# EAGLE schematic FM-Super-Regenerative-2 (EAGLE 7.2.0)
Pendelaudion Aus dem Sperrschicht-Feldeffekttransistor BF256B Super-Regen FM Radio: "Radio Shack Special" http://ryanzachry.com/2013/01/super-regen-fm-radio/
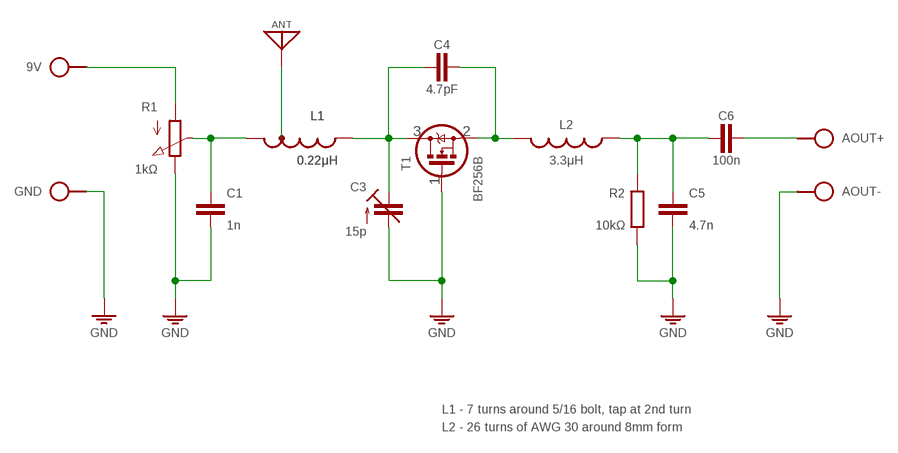
[diagram p0: schematic, sheet 1]

## Parts
9V  SPAD  [SPAD]
ANT  ANT  [SPAD]
AOUT+  SPAD  [SPAD]
AOUT-  SPAD  [SPAD]
C1  1n  C025-025X060  [C050-025X060]
C3  15p  C-TR-PH201272222-808-2PINB  [TRIM-2222-808]
C4  4.7pF  C025-020X036  [C025-020X036]
C5  4.7n  C050-020X044  [C050-020X044]
C6  100n  C050-020X044  [C050-020X044]
GND  SPAD  [SPAD]
L1  0.22μH  L-TAP1L-08/12-X-TAP1  [L-08/12-X-TAP1]
L2  3.3μH  L-BODY  [L-BODY]
R1  1kΩ  POT  [POT]
R2  10kΩ  R0204/10  [0204/10]
T1  BF256B  [TO92]

## Nets
GND: AOUT-.1 C1.2 C3.2(A) C5.2 GND.1 R1.3(E) R2.1 T1.1(G)
N$1: 9V.1 R1.1(A)
N$2: C3.3(E) C4.1 L1.2 T1.3(D)
N$3: C1.1 L1.1 R1.2(S)
N$4: ANT.1 L1.3(T)
N$5: C4.2 L2.3 T1.2(S)
N$6: C5.1 C6.1 L2.2 R2.2
N$8: AOUT+.1 C6.2

## Notes on the sheet
- L1 - 7 turns around 5/16 bolt, tap at 2nd turn
- L2 - 26 turns of AWG 30 around 8mm form

## Library data of the parts
9V AOUT+ AOUT- GND = pad:SPAD
ANT = pad:ANT
C1 C4-C6 = c:C: CAPACITOR, European symbol
C3 = cap-trim:C-TR-PH20127
L1 = l:L-TAP1
L2 = l:L: Potentiometers Beckman, Copal, Piher, Spectrol, Schukat Created by librarian@cadsoft.de
R1 = r:POT
R2 = r:R: RESISTOR, European symbol
T1 = t:BF256B

## Net classes
0 default: width 0.61 mm